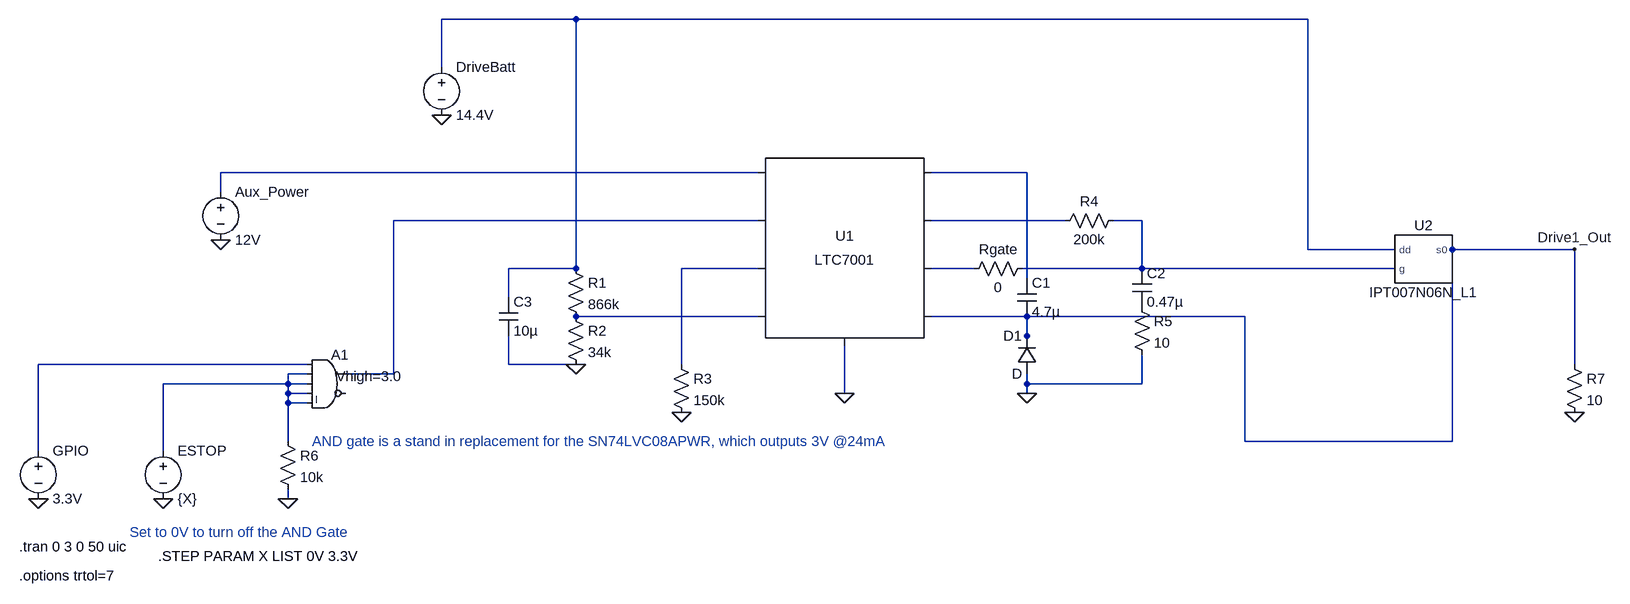
[diagram p0: schematic DrivetrainSim.asc]
DrivetrainSim.asc, the LTspice schematic file:
Version 4
SHEET 1 2324 720
WIRE -160 -224 -384 -224
WIRE 1440 -224 -160 -224
WIRE -384 -144 -384 -224
WIRE 144 32 -752 32
WIRE 592 32 432 32
WIRE -752 64 -752 32
WIRE 144 112 -464 112
WIRE 656 112 432 112
WIRE 784 112 736 112
WIRE 1440 160 1440 -224
WIRE 1600 160 1440 160
WIRE 2240 160 1696 160
WIRE -160 192 -160 -224
WIRE -160 192 -272 192
WIRE 144 192 16 192
WIRE 504 192 432 192
WIRE 784 192 784 112
WIRE 784 192 584 192
WIRE 1600 192 784 192
WIRE 592 208 592 32
WIRE -272 240 -272 192
WIRE 144 272 -160 272
WIRE 592 272 432 272
WIRE 1100 272 592 272
WIRE 592 304 592 272
WIRE 592 320 592 304
WIRE -608 352 -1056 352
WIRE -272 352 -272 304
WIRE -160 352 -272 352
WIRE 16 352 16 192
WIRE 2240 352 2240 160
WIRE -608 368 -640 368
WIRE -464 368 -464 112
WIRE -464 368 -544 368
WIRE -640 384 -640 368
WIRE -640 384 -848 384
WIRE -608 384 -640 384
WIRE 592 384 592 368
WIRE 784 384 784 336
WIRE 784 384 592 384
WIRE -640 400 -640 384
WIRE -608 400 -640 400
WIRE 288 400 288 320
WIRE 592 400 592 384
WIRE -640 416 -640 400
WIRE -608 416 -640 416
WIRE -640 480 -640 416
WIRE 1100 480 1100 272
WIRE 1696 480 1696 160
WIRE 1696 480 1100 480
WIRE -1056 496 -1056 352
WIRE -848 496 -848 384
WIRE -640 576 -640 560
FLAG 288 400 0
FLAG -160 352 0
FLAG -752 144 0
FLAG 16 432 0
FLAG 592 400 0
FLAG -384 -64 0
FLAG -1056 576 0
FLAG -640 576 0
FLAG -848 576 0
FLAG 2240 432 0
FLAG 2240 160 Drive1_Out
SYMBOL PowerProducts\\LTC7001 288 160 R0
SYMATTR InstName U1
SYMBOL IPT007N06N 1648 176 R0
SYMATTR InstName U2
SYMBOL res -176 176 R0
SYMATTR InstName R1
SYMATTR Value 866k
SYMBOL res -176 256 R0
SYMATTR InstName R2
SYMATTR Value 34k
SYMBOL voltage -752 48 R0
SYMATTR InstName Aux_Power
SYMATTR Value 12V
SYMBOL res 0 336 R0
SYMATTR InstName R3
SYMATTR Value 150k
SYMBOL diode 608 368 R180
WINDOW 0 24 64 Left 2
WINDOW 3 24 0 Left 2
SYMATTR InstName D1
SYMBOL cap 576 208 R0
SYMATTR InstName C1
SYMATTR Value 4.7µ
SYMATTR SpiceLine IC=12
SYMBOL res 752 96 R90
WINDOW 0 0 56 VBottom 2
WINDOW 3 32 56 VTop 2
SYMATTR InstName R4
SYMATTR Value 200k
SYMBOL cap 768 192 R0
SYMATTR InstName C2
SYMATTR Value 0.47µ
SYMBOL res 768 240 R0
SYMATTR InstName R5
SYMATTR Value 10
SYMBOL voltage -384 -160 R0
SYMATTR InstName DriveBatt
SYMATTR Value 14.4V
SYMBOL Digital\\and -576 320 R0
WINDOW 39 16 52 Left 2
SYMATTR SpiceLine Vhigh=3.0
SYMATTR InstName A1
SYMBOL voltage -1056 480 R0
SYMATTR InstName GPIO
SYMATTR Value 3.3V
SYMBOL res -656 464 R0
SYMATTR InstName R6
SYMATTR Value 10k
SYMBOL voltage -848 480 R0
SYMATTR InstName ESTOP
SYMATTR Value {X}
SYMBOL res 2224 336 R0
SYMATTR InstName R7
SYMATTR Value 10
SYMBOL res 600 176 R90
WINDOW 0 0 56 VBottom 2
WINDOW 3 32 56 VTop 2
SYMATTR InstName Rgate
SYMATTR Value 0
SYMBOL cap -288 240 R0
SYMATTR InstName C3
SYMATTR Value 10µ
TEXT -904 632 Left 2 ;Set to 0V to turn off the AND Gate
TEXT -1088 656 Left 2 !.tran 0 3 0 50 uic
TEXT -1088 704 Left 2 !.options trtol=7
TEXT -856 672 Left 2 !.STEP PARAM X LIST 0V 3.3V
TEXT -600 480 Left 2 ;AND gate is a stand in replacement for the SN74LVC08APWR, which outputs 3V @24mA

The netlist it stands for:
* DrivetrainSim.asc
XU1 N002 N007 0 N004 N009 N008 N005 Drive1_Out N003 LTC7001
XU2 N001 N006 Drive1_Out IPT007N06N_L1  ; pins dd g s0
R1 N001 N009 866k
R2 N009 0 34k
V§Aux_Power N002 0 12V
R3 N007 0 150k
D1 0 Drive1_Out D
C1 N003 Drive1_Out 4.7µ IC=12
R4 N006 N005 200k
C2 N006 P001 0.47µ
R5 P001 0 10
V§DriveBatt N001 0 14.4V
A1 N010 N011 N011 N011 N011 0 N004 0 AND Vhigh=3.0
V§GPIO N010 0 3.3V
R6 N011 0 10k
V§ESTOP N011 0 {X}
R7 Drive1_Out 0 10
Rgate N006 N008 0
C3 N001 0 10µ
.model D D
.lib standard.dio
* Set to 0V to turn off the AND Gate
.tran 0 3 0 50 uic
.options trtol=7
.STEP PARAM X LIST 0V 3.3V
* AND gate is a stand in replacement for the SN74LVC08APWR, which outputs 3V @24mA
.lib LTC7001.sub
.lib C:\Users\Luca Lanzillotta\Documents\GitHub\billee-hardware-2026\BILLEE_Rover_Control_Module_V1\sims\DrivetrainSim\OptiMOS_OptiMOS5_60V_LTSpice.lib
.backanno
.end